# EAGLE schematic RasPi-BplusHAT_CamSlot (EAGLE 7.4.0)
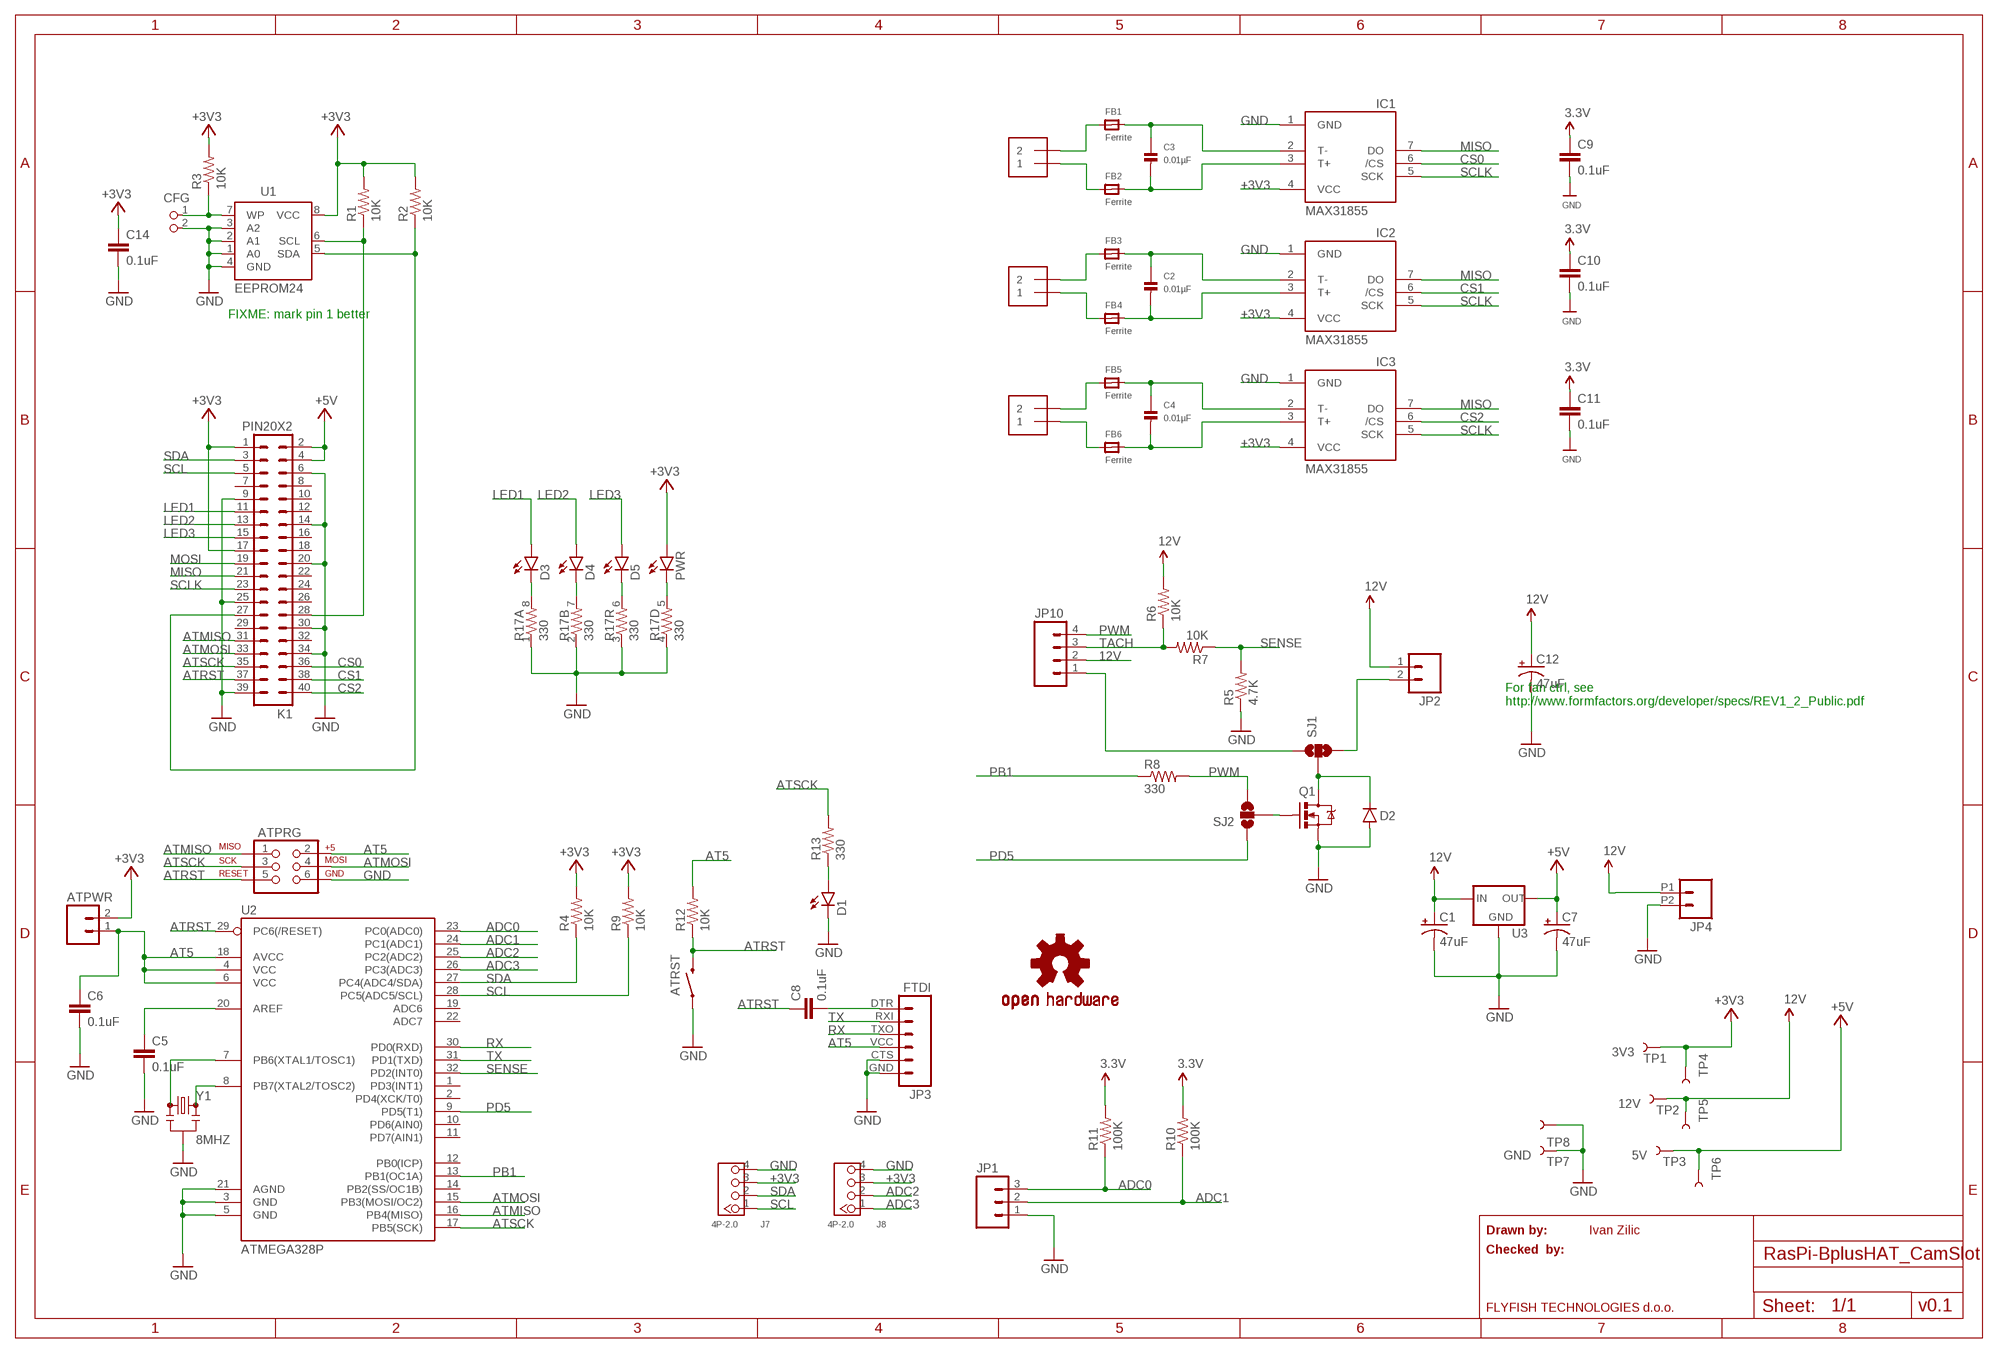
[diagram p0: schematic, sheet 1]

## Parts
ATPRG  AVR_SPI_PRG_62X3_LOCK  [2X3_LOCK]
ATPWR  M02LOCK  [1X02_LOCK]
ATRST  SWITCH-MOMENTARY-2PTH  [TACTILE-PTH]
C1  47uF  CAP_POL7343  [EIA7343]
C2  0.01µF  CAP_CERAMIC_0805  [_0805]
C3  0.01µF  CAP_CERAMIC_0805  [_0805]
C4  0.01µF  CAP_CERAMIC_0805  [_0805]
C5  0.1uF  0.1UF-25V(+80/-20%)(0603)  [0603-CAP]
C6  0.1uF  0.1UF-25V(+80/-20%)(0603)  [0603-CAP]
C7  47uF  CAP_POL7343  [EIA7343]
C8  0.1uF  0.1UF-25V(+80/-20%)(0603)  [0603-CAP]
C9  0.1uF  CAP0805  [0805]
C10  0.1uF  CAP0805  [0805]
C11  0.1uF  CAP0805  [0805]
C12  47uF  CAP_POL7343  [EIA7343]
C14  0.1uF  CAP0805  [0805]
CFG  PIN2_100  [PIN_W_2]
D1  LED0603  [LED-0603]
D2  250mA  DIODEBAS16  [SOD-323]
D3  LED0603  [LED-0603]
D4  LED0603  [LED-0603]
D5  LED0603  [LED-0603]
FB1  Ferrite  FERRITE_0805  [_0805]
FB2  Ferrite  FERRITE_0805  [_0805]
FB3  Ferrite  FERRITE_0805  [_0805]
FB4  Ferrite  FERRITE_0805  [_0805]
FB5  Ferrite  FERRITE_0805  [_0805]
FB6  Ferrite  FERRITE_0805  [_0805]
IC1  MAX31855  MAX6675  [SO08]
IC2  MAX31855  MAX6675  [SO08]
IC3  MAX31855  MAX6675  [SO08]
J1  1X2-3.5MM  [1X2-3.5MM]
J2  1X2-3.5MM  [1X2-3.5MM]
J3  1X2-3.5MM  [1X2-3.5MM]
J7  4P-2.0  GROVE-CONNECTOR-DIP(4P-2.0)  [HW4-2.0]
J8  4P-2.0  GROVE-CONNECTOR-DIP(4P-2.0)  [HW4-2.0]
JP1  M03SCREW  [SCREWTERMINAL-3.5MM-3]
JP2  M02POLAR_LOCK  [MOLEX-1X2_LOCK]
JP3  FTDI  FTDI_BASICPTH  [FTDI_BASIC]
JP4  M022.54MM_SCREWTERM  [1X02_2.54_SCREWTERM]
JP10  M04POLAR_LOCK  [MOLEX-1X4_LOCK]
K1  PIN20X2  [PIN_20X2]
LOGO1  OSHW-LOGOM  [OSHW-LOGO-M]
PWR  LED0603  [LED-0603]
Q1  NFET-FDD8780  MOSFET-NCHANNELFDD8780  [DPAK]
R1  10K  10KOHM-1/10W-1%(0603)0603  [0603-RES]
R2  10K  10KOHM-1/10W-1%(0603)0603  [0603-RES]
R3  10K  10KOHM-1/10W-1%(0603)0603  [0603-RES]
R4  10K  10KOHM-1/10W-1%(0603)0603  [0603-RES]
R5  4.7K  4.7KOHM-1/10W-1%(0603)  [0603-RES]
R6  10K  10KOHM-1/10W-1%(0603)0603  [0603-RES]
R7  10K  10KOHM-1/10W-1%(0603)0603  [0603-RES]
R8  330  RESISTOR0603  [0603-RES]
R9  10K  10KOHM-1/10W-1%(0603)0603  [0603-RES]
R10  100K  10KOHM-1/10W-1%(0603)0603  [0603-RES]
R11  100K  10KOHM-1/10W-1%(0603)0603  [0603-RES]
R12  10K  10KOHM-1/10W-1%(0603)0603  [0603-RES]
R13  330  RESISTOR0603  [0603-RES]
R17  330  RESISTOR-ARRAY0603-ARV  [0603-ARV]
SJ1  SOLDERJUMPER_2WAYS  [SJ_3]
SJ2  SOLDERJUMPER_2WAYS  [SJ_3]
TP1  3V3  TEST-POINT3X4  [PAD.03X.04]
TP2  12V  TEST-POINT3X4  [PAD.03X.04]
TP3  5V  TEST-POINT3X4  [PAD.03X.04]
TP4  3V3  TEST-POINTTP_15TH_THRU  [TP_15TH]
TP5  3V3  TEST-POINTTP_15TH_THRU  [TP_15TH]
TP6  3V3  TEST-POINTTP_15TH_THRU  [TP_15TH]
TP7  GND  TEST-POINT3X4  [PAD.03X.04]
TP8  3V3  TEST-POINTTP_15TH_THRU  [TP_15TH]
U1  EEPROM24  [SOIC8]
U2  ATMEGA328P  ATMEGA328P_TQFP  [TQFP32-08]
U3  V_REG_78XXSINK  [TO220-IGO]
Y1  8MHZ  RESONATOR8MHZ  [RESONATOR-SMD]

## Nets
12V [power]: C1.A(+) C12.A(+) JP2.1 JP4.P1 JP10.2 R6.2 TP2.P$1 TP5.P$1 U3.IN
+3V3 [power]: ATPWR.2 C9.1 C10.1 C11.1 C14.1 IC1.4(VCC) IC2.4(VCC) IC3.4(VCC) J7.3 J8.3 K1.1 K1.17 PWR.A R1.2 R2.2 R3.2 R4.2 R9.2 R10.2 R11.2 TP1.P$1 TP4.P$1 U1.8(VCC) ; supply symbol labelled 3.3V
+5V [power]: C7.A(+) K1.2 K1.4 TP3.P$1 TP6.P$1 U3.OUT
ADC0: JP1.3 R11.1 U2.23(PC0(ADC0))
ADC1: JP1.2 R10.1 U2.24(PC1(ADC1))
ADC2: J8.2 U2.25(PC2(ADC2))
ADC3: J8.1 U2.26(PC3(ADC3))
AT5 [power]: ATPRG.2 ATPWR.1 C6.1 JP3.VCC R12.2 U2.4(VCC) U2.6(VCC) U2.18(AVCC)
ATMISO: ATPRG.1 K1.31 U2.16(PB4(MISO))
ATMOSI: ATPRG.4 K1.33 U2.15(PB3(MOSI/OC2))
ATRST: ATPRG.5 ATRST.3 C8.1 K1.37 R12.1 U2.29(PC6(/RESET))
ATSCK: ATPRG.3 K1.35 R13.2 U2.17(PB5(SCK))
CS0: IC1.6(/CS) K1.36
CS1: IC2.6(/CS) K1.38
CS2: IC3.6(/CS) K1.40
GND [power]: ATPRG.6 ATRST.1 C1.C(-) C5.2 C6.2 C7.C(-) C9.2 C10.2 C11.2 C12.C(-) C14.2 CFG.2 D1.C D2.A IC1.1(GND) IC2.1(GND) IC3.1(GND) J7.4 J8.4 JP1.1 JP3.CTS JP3.GND JP4.P2 K1.6 K1.9 K1.14 K1.20 K1.25 K1.30 K1.34 K1.39 Q1.3(S) R5.1 R17.1 R17.2 R17.3 R17.4 TP7.P$1 TP8.P$1 U1.1(A0) U1.2(A1) U1.3(A2) U1.4(GND) U2.3(GND) U2.5(GND) U2.21(AGND) U3.GND Y1.2
LED1: D3.A K1.11
LED2: D4.A K1.13
LED3: D5.A K1.15
MISO: IC1.7(DO) IC2.7(DO) IC3.7(DO) K1.21
MOSI: K1.19
N$1: K1.28 R1.1 U1.6(SCL)
N$2: K1.27 R2.1 U1.5(SDA)
N$3: CFG.1 R3.1 U1.7(WP)
N$4: FB1.1 J1.2
N$5: C3.1 FB1.2 IC1.2(T-)
N$6: FB2.1 J1.1
N$7: C3.2 FB2.2 IC1.3(T+)
N$8: FB3.1 J2.2
N$9: C2.1 FB3.2 IC2.2(T-)
N$10: FB4.1 J2.1
N$11: C2.2 FB4.2 IC2.3(T+)
N$12: FB5.1 J3.2
N$13: C4.1 FB5.2 IC3.2(T-)
N$14: FB6.1 J3.1
N$15: C4.2 FB6.2 IC3.3(T+)
N$16 [power]: JP2.2 SJ1.3
N$17 [power]: JP10.1 SJ1.1
N$18: C5.1 U2.20(AREF)
N$19: C8.2 JP3.DTR
N$20: D1.A R13.1
N$21: D3.C R17.8
N$22 [power]: D2.C Q1.4(D) SJ1.2
N$23: D4.C R17.7
N$24: D5.C R17.6
N$25: Q1.1(G) SJ2.2
N$26: U2.7(PB6(XTAL1/TOSC1)) Y1.1
N$27: U2.8(PB7(XTAL2/TOSC2)) Y1.3
PB1: R8.1 U2.13(PB1(OC1A))
PD5: SJ2.1 U2.9(PD5(T1))
PWM: JP10.4 R8.2 SJ2.3
PWR: PWR.C R17.5
RX: JP3.TXO U2.30(PD0(RXD))
SCL: J7.1 K1.5 R9.1 U2.28(PC5(ADC5/SCL))
SCLK: IC1.5(SCK) IC2.5(SCK) IC3.5(SCK) K1.23
SDA: J7.2 K1.3 R4.1 U2.27(PC4(ADC4/SDA))
SENSE: R5.2 R7.1 U2.32(PD2(INT0))
TACH: JP10.3 R6.1 R7.2
TX: JP3.RXI U2.31(PD1(TXD))
Unconnected: K1.7 K1.8 K1.10 K1.12 K1.16 K1.18 K1.22 K1.24 K1.26 K1.29 K1.32 U2.1(PD3(INT1)) U2.2(PD4(XCK/T0)) U2.10(PD6(AIN0)) U2.11(PD7(AIN1)) U2.12(PB0(ICP)) U2.14(PB2(SS/OC1B)) U2.19(ADC6) U2.22(ADC7)

## Notes on the sheet
- FIXME: mark pin 1 better
- For fan ctrl, see
  http://www.formfactors.org/developer/specs/REV1_2_Public.pdf
- Drawn by: | Ivan Zilic
- Checked  by:
- FLYFISH TECHNOLOGIES d.o.o. | v0.1

## Library data of the parts
ATPRG = SparkFun-Connectors:AVR_SPI_PRG_6: AVR ISP 6 Pin This is the reduced ISP connector for AVR programming. Common on Arduino. This footprint will take up less PCB space and can be used with a 10-pin to 6-pin adapter such as SKU: BOB-08508 **Special note about "TEST_POINT" package. The stop mask is on the top side, so if you want your programming test points to be on the bottom of your board, make sure to place this package on the bottom side of the board. This also ensure that the orientation to program from the bottom side will be correct.
ATPWR JP2 JP4 = SparkFun-Connectors:M02: Standard 2-pin 0.1" header. Use with - straight break away headers ( PRT-00116) - right angle break away headers (PRT-00553) - swiss pins (PRT-00743) - machine pins (PRT-00117) - female headers (PRT-00115) Molex polarized connector foot print use with: PRT-08233 with associated crimp pins and housings. 2.54_SCREWTERM for use with PRT-10571. 3.5mm Screw Terminal footprints for PRT-08084 5mm Screw Terminal footprints for use with PRT-08432
ATRST = SparkFun-Electromechanical:SWITCH-MOMENTARY-2: Various NO switches- pushbuttons, reed, etc; PROD_ID: SWCH-08441
C1 C7 C12 = SparkFun-Capacitors:CAP_POL: Capacitor Polarized These are standard SMD and PTH capacitors. Normally 10uF, 47uF, and 100uF in electrolytic and tantalum varieties. Always verify the external diameter of the through hole cap, it varies with capacity, voltage, and manufacturer. The EIA devices should be standard.; PROD_ID: CAP-08702
C2-C4 = microbuilder:CAP_CERAMIC: Ceramic Capacitors 0402 - 0402 Surface Mount Capacitors 16pF 50V 5% [Digikey: 445-4899-2-ND] 18pF 50V 5% [Digikey: 490-1281-2-ND] 22pF 50V 5% [Digikey: 490-1283-2-ND] 68pF 50V 5% [Digikey: 490-1289-2-ND] 0.1uF 10V 10% [Digikey: 490-1318-2-ND] 1.0uF 6.3V 10% [Digikey: 490-1320-2-ND] 0603 - 0603 Surface Mount Capacitors 16 pF 50V 5% [Digikey: 445-5051-2-ND] 22 pF 50V [Digikey: PCC220ACVTR-ND] 33 pF 50V 5% [Digikey: 490-1415-1-ND] 56pF 50V 5% [Digikey: 490-1421-1-ND] 220pF 50V 5% [Digikey: 445-1285-1-ND] 680 pF 50V 2200 pF 50V 5% C0G [Digikey: 445-1297-1-ND] 5600 pF 100V 5% X7R [Digikey: 478-3711-1-ND] 0.1 µF 25V 10% [Digikey: PCC2277TR-ND] 0.22 µF 16V 10% X7R [Digikey: 445-1318-1-ND] 1.0 µF 25V 10% [Digikey: 445-5146-2-ND] 0603 - RF Specific 3pF 250V +/-0.1pF RF [Digikey: 712-1347-1-ND] 18 pF 250V 5% [Digikey: 478-3505-1-ND or 712-1322-1-ND] 56 pF 250V 5% C0G RF [Digikey: 490-4867-1-ND] 68 pF 250V RF [Digikey: 490-4868-1-ND] 0805 - 0805 Surface Mount Capacitors 220 pF 250V 2% RF Ceramic Capacitor [Digikey: 712-1398-1-ND] 1000 pF 50V 2% NP0 Ceramic Capacitor [Digikey: 478-3760-1-ND] 0.1 µF 25V 10% Ceramic Capacitor [Digikey: PCC1828TR-ND] 1.0 µF 16V 10% Ceramic Capacitor[Digikey: 490-1691-2-ND] 10.0 µF 10V 10% Ceramic Capacitor[Digikey: 709-1228-1-ND] 10.0 uF 16V 10% Ceramic Capacitor [Digikey: 478-5165-2-ND] 47 uF 6.3V 20% Ceramic Capacitor [Digikey: 587-1779-1-ND or 399-5506-1-ND] 1206 - 1206 Surface Mount Capacitors 47uF 10V 20% Ceramic Capacitor [Digikey: 490-5528-1-ND or 399-5508-1-ND or 445-6010-1-ND] 100uF 6.3V -20%, +80% Y5V Ceramic Capacitor (Digikey: 490-4512-1-ND, Mouser: 81-GRM31CF50J107ZE1L)
C5 C6 C8 = SparkFun-Capacitors:0.1UF-25V(+80/-20%)(0603): CAP-00810 Ceramic Standard decoupling cap; PROD_ID: CAP-00810
C9-C11 C14 = SparkFun-Passives:CAP: Capacitor Standard 0603 ceramic capacitor, and 0.1" leaded capacitor.
CFG = FLYFISH:PIN2
D1 D3-D5 PWR = SparkFun-LED:LED: LEDs Standard schematic elements and footprints for 5mm, 3mm, 1206, and 0603 sized LEDs. 5mm - Spark Fun Electronics SKU : COM-00529 (and others)
D2 = SparkFun-DiscreteSemi:DIODE: Diode These are standard reverse protection diodes and small signal diodes. SMA package can handle up to about 1A. SOD-323 can handle about 200mA. What the SOD-323 package when ordering, there are some mfgs out there that are 5-pin packages.; PROD_ID: DIO-09646; VALUE: 250mA/100V
FB1-FB6 = microbuilder:FERRITE: Ferrite Bead 0603 MMZ1608B121C - 120 Ohm @ 100MHz, 600mA, 0.15 Ohm DC Resistance - Digikey: 445-2164-1-ND BK1608HW121-T - 120 Ohm, 600mA Ferrite Chip - Digikey: 587-1876-2-ND 0805 HZ0805B272R-10 - 2.7K Ohm @ 100MHz, 200mA, 0.8 Ohm DC Resistance - Digikey: 240-2504-1-ND (see also Murata BLM21BD272SN1L) MMZ2012Y152B - 1.5K Ohm @ 100MHz, 500mA, 0.4 Ohm DC Resistance - Digikey: 445-1560-1-ND - Mainly for high frequency (80-400MHz) MMZ2012R102A - 1K Ohm @ 100MHz, 500mA, 0.3 Ohm DC Resistance - Digikey: 445-1555-2-ND - More general purpose (10-200MHz)
IC1-IC3 = adafruit:MAX6675
J1-J3 = adafruit:1X2: 3.5mm Terminal block http://www.ladyada.net/library/pcb/eaglelibrary.html
J7 J8 = Seeed-OPL-Connector:GROVE-CONNECTOR-DIP(4P-2.0): 320110033
JP1 = SparkFun-Connectors:M03: Header 3 Standard 3-pin 0.1" header. Use with straight break away headers (SKU : PRT-00116), right angle break away headers (PRT-00553), swiss pins (PRT-00743), machine pins (PRT-00117), and female headers (PRT-00115). Molex polarized connector foot print use with SKU : PRT-08232 with associated crimp pins and housings.; PROD_ID: CONN-08288
JP3 = SparkFun-Connectors:FTDI_BASIC: FTDI Basic header with labels
JP10 = SparkFun-Connectors:M04: Header 4 Standard 4-pin 0.1" header. Use with straight break away headers (SKU : PRT-00116), right angle break away headers (PRT-00553), swiss pins (PRT-00743), machine pins (PRT-00117), and female headers (PRT-00115). Molex polarized connector foot print use with SKU : PRT-08231 with associated crimp pins and housings. 1MM SMD Version SKU: PRT-10208
K1 = FLYFISH:PIN20X2
LOGO1 = SparkFun-Aesthetics:OSHW-LOGO: Open Source Hardware Logo This logo indicates the piece of hardware it is found on incorporates a OSHW license and/or adheres to the definition of open source hardware found here: http://freedomdefined.org/OSHW
Q1 = SparkFun-DiscreteSemi:MOSFET-NCHANNEL: Common NMOSFET Parts MFG P/N Store ID Prod ID FDD8780 TRANS-09984 SI7820DN TRANS-11055 FDS6630A IC-08089 2N7002PW TRANS-11151 FQP30N06L COM-10213 TRANS-10060 BSS123LT1G TRANS-08345 BSS138 TRANS-00830 BS170 2N7000; PROD_ID: TRANS-09984
R1-R4 R6 R7 R9 R12 = SparkFun-Resistors:10KOHM-1/10W-1%(0603): RES-00824; PROD_ID: RES-00824
R5 = SparkFun-Resistors:4.7KOHM-1/10W-1%(0603): RES-07857; PROD_ID: RES-07857
R8 R13 = SparkFun-Resistors:RESISTOR: Resistor Basic schematic elements and footprints for 0603, 1206, and PTH resistors.
R10 R11 = SparkFun-Resistors:10KOHM-1/10W-1%(0603): RES-00824; PROD_ID: RES-00824; VALUE: 10K
R17 = SparkFun-Resistors:RESISTOR-ARRAY: Array Chip Resistor Source: RS Component / Phycomp
SJ1 SJ2 = SparkFun-Retired:SOLDERJUMPER_2WAY: Solder Jumper 2 way solder jumper
TP1-TP8 = SparkFun-Passives:TEST-POINT: Bare copper test points for troubleshooting or ICT
U1 = FLYFISH:EEPROM24
U2 = SparkFun-DigitalIC:ATMEGA328P_TQFP; PROD_ID: IC-09069; VALUE: ATMEGA328P_TQFP
U3 = SparkFun-PowerIC:V_REG_78XX: Voltage Regulator Standard 78xx regulator. IGO (Input Ground Output). Spark Fun Electronics SKU : COM-00107
Y1 = SparkFun-FreqCtrl:RESONATOR: Resonator Small SMD resonator. Used, eg, on the Arduino Pro/ Pro Mini boards. 8MHz- XTAL-08895 16MHz- XTAL-08900; PROD_ID: XTAL-08895

## Net classes
1 power: width 0.305 mm